# EAGLE schematic voice board (EAGLE 7.2.0)
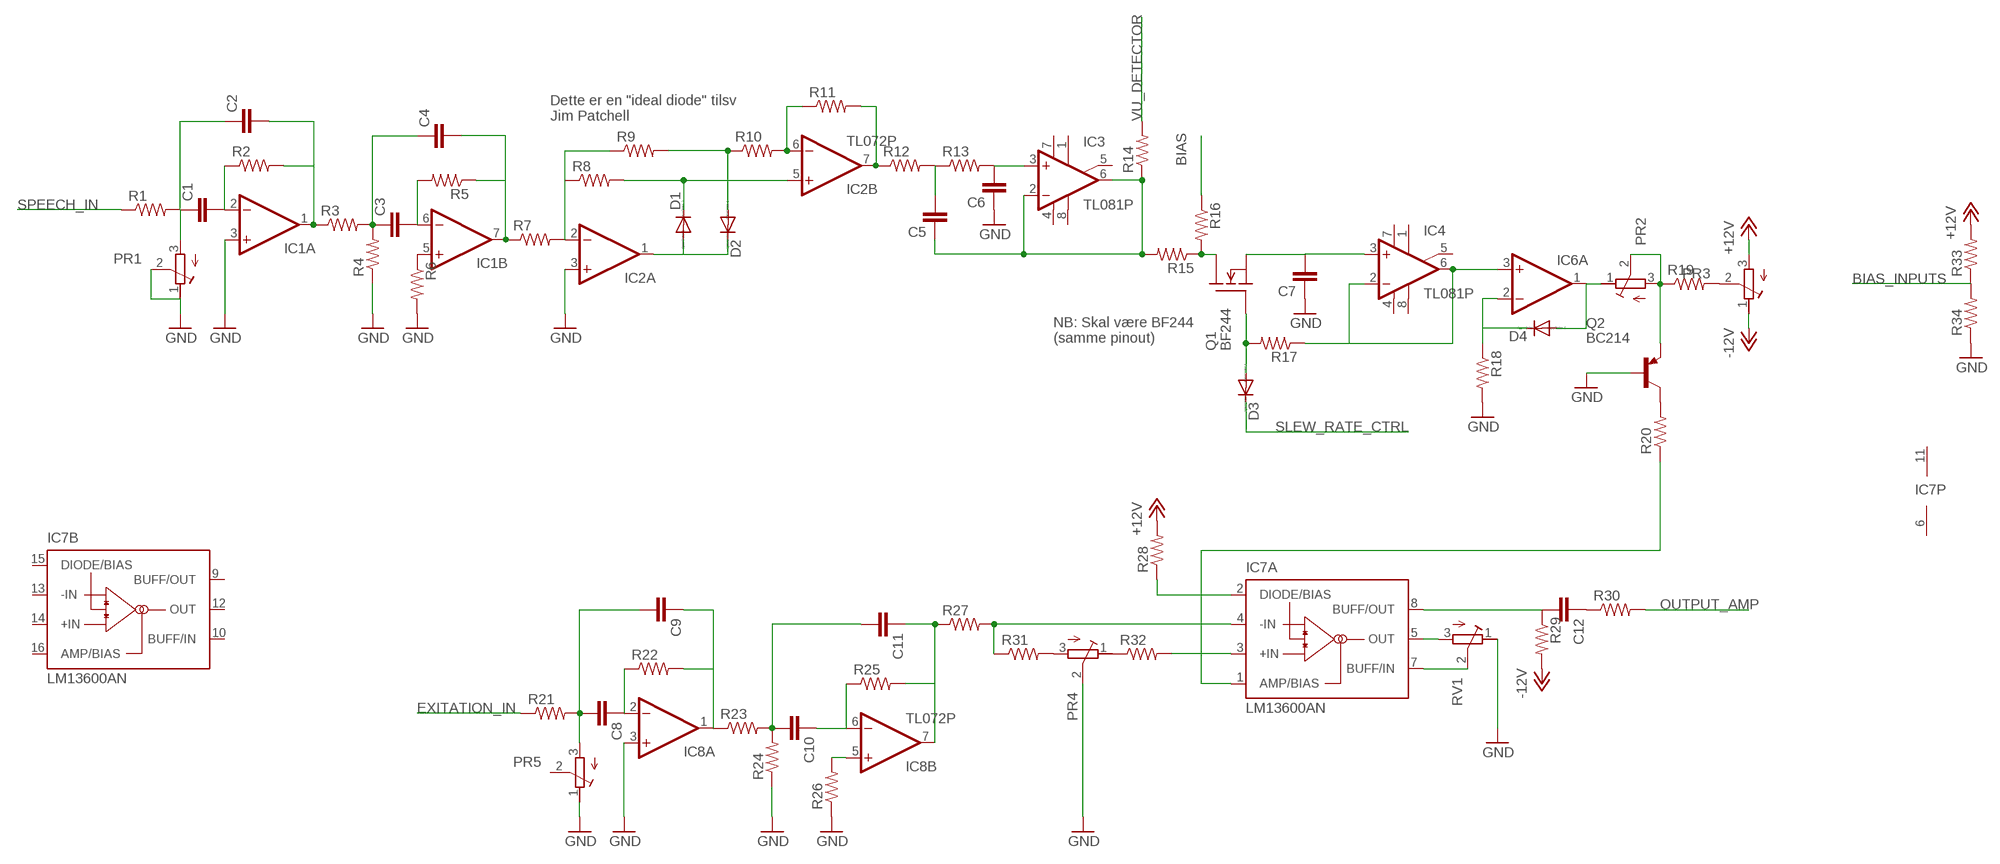
[diagram p0: schematic, sheet 1]

## Parts
C1  C-EU050-025X075  [C050-025X075]
C2  C-EU050-025X075  [C050-025X075]
C3  C-EU050-025X075  [C050-025X075]
C4  C-EU050-025X075  [C050-025X075]
C5  C-EU050-025X075  [C050-025X075]
C6  C-EU050-025X075  [C050-025X075]
C7  C-EU050-025X075  [C050-025X075]
C8  C-EU050-025X075  [C050-025X075]
C9  C-EU050-025X075  [C050-025X075]
C10  C-EU050-025X075  [C050-025X075]
C11  C-EU050-025X075  [C050-025X075]
C12  C-EU050-025X075  [C050-025X075]
D1  DIODE-D-5  [D-5]
D2  DIODE-D-5  [D-5]
D3  DIODE-D-5  [D-5]
D4  DIODE-D-5  [D-5]
IC1  TL072P  [DIL08]
IC2  TL072P  [DIL08]
IC3  TL081P  [DIL08]
IC4  TL081P  [DIL08]
IC6  TL072P  [DIL08]
IC7  LM13600AN  [DIL16]
IC8  TL072P  [DIL08]
PR1  R-TRIMMT93XA  [RTRIMT93XA]
PR2  R-TRIMMT93XA  [RTRIMT93XA]
PR3  R-TRIMMT93XA  [RTRIMT93XA]
PR4  R-TRIMMT93XA  [RTRIMT93XA]
PR5  R-TRIMMT93XA  [RTRIMT93XA]
Q1  BF244  TN0602N3  [TO-92]
Q2  BC214  [TO92]
R1  R-US_0207/7  [0207/7]
R2  R-US_0207/7  [0207/7]
R3  R-US_0207/7  [0207/7]
R4  R-US_0207/7  [0207/7]
R5  R-US_0207/7  [0207/7]
R6  R-US_0207/7  [0207/7]
R7  R-US_0207/7  [0207/7]
R8  R-US_0207/7  [0207/7]
R9  R-US_0207/7  [0207/7]
R10  R-US_0207/7  [0207/7]
R11  R-US_0207/7  [0207/7]
R12  R-US_0207/7  [0207/7]
R13  R-US_0207/7  [0207/7]
R14  R-US_0207/7  [0207/7]
R15  R-US_0207/7  [0207/7]
R16  R-US_0207/7  [0207/7]
R17  R-US_0207/7  [0207/7]
R18  R-US_0207/7  [0207/7]
R19  R-US_0207/7  [0207/7]
R20  R-US_0207/7  [0207/7]
R21  R-US_0207/7  [0207/7]
R22  R-US_0207/7  [0207/7]
R23  R-US_0207/7  [0207/7]
R24  R-US_0207/7  [0207/7]
R25  R-US_0207/7  [0207/7]
R26  R-US_0207/7  [0207/7]
R27  R-US_0207/7  [0207/7]
R28  R-US_0207/7  [0207/7]
R29  R-US_0207/7  [0207/7]
R30  R-US_0207/7  [0207/7]
R31  R-US_0207/7  [0207/7]
R32  R-US_0207/7  [0207/7]
R33  R-US_0207/7  [0207/7]
R34  R-US_0207/7  [0207/7]
RV1  R-TRIMMT93XA  [RTRIMT93XA]

## Nets
+12V: PR3.3(A) R28.2 R33.2
-12V: PR3.1(E) R29.2
BIAS: R16.1
BIAS_INPUTS: R33.1 R34.2
EXITATION_IN: R21.1
GND: C6.1 C7.1 IC1.3(A:+IN) IC2.3(A:+IN) IC8.3(A:+IN) PR1.1(E) PR1.2(S) PR4.2(S) PR5.1(E) Q2.2(B) R4.1 R6.2 R18.2 R24.1 R26.1 R34.1 RV1.1(E)
N$1: C1.2 IC1.2(A:-IN) R2.1
N$2: C1.1 C2.1 PR1.3(A) R1.2
N$3: C2.2 IC1.1(A:OUT) R2.2 R3.1
N$4: IC2.2(A:-IN) R7.2 R8.1 R9.1
N$5: C3.1 C4.1 R3.2 R4.2
N$6: C3.2 IC1.6(B:-IN) R5.2
N$7: IC1.5(B:+IN) R6.1
N$8: C4.2 IC1.7(B:OUT) R5.1 R7.1
N$9: D1.C IC2.5(B:+IN) R8.2
N$10: D1.A D2.C IC2.1(A:OUT)
N$11: D2.A R9.2 R10.1
N$12: IC2.6(B:-IN) R10.2 R11.1
N$13: IC2.7(B:OUT) R11.2 R12.1
N$14: C5.2 R12.2 R13.1
N$15: C5.1 IC3.2(-IN) IC3.6(OUT) R14.1 R15.2
N$16: C6.2 IC3.3(+IN) R13.2
N$17: Q1.3(D) R15.1 R16.2
N$18: C7.2 IC4.3(+IN) Q1.1(S)
N$19: D3.A Q1.2(G) R17.2
N$20: IC4.2(-IN) IC4.6(OUT) IC6.3(A:+IN) R17.1
N$21: D4.C IC6.2(A:-IN) R18.1
N$22: D4.A IC6.1(A:OUT) PR2.1(E)
N$23: PR2.2(S) PR2.3(A) Q2.1(E) R19.1
N$24: PR3.2(S) R19.2
N$25: Q2.3(C) R20.2
N$26: PR4.3(A) R31.2
N$27: C8.2 C9.2 PR5.3(A) R21.2
N$28: C10.2 C11.2 R23.2 R24.2
N$29: C8.1 IC8.2(A:-IN) R22.1
N$30: C9.1 IC8.1(A:OUT) R22.2 R23.1
N$31: C10.1 IC8.6(B:-IN) R25.1
N$32: IC8.5(B:+IN) R26.2
N$33: C12.2 IC7.8(A:BUFF/OUT) R29.1
N$34: C12.1 R30.1
N$35: C11.1 IC8.7(B:OUT) R25.2 R27.1
N$36: PR4.1(E) R32.1
N$37: IC7.3(A:+IN) R32.2
N$38: IC7.2(A:DIODE/BIAS) R28.1
N$39: IC7.4(A:-IN) R27.2 R31.1
N$40: IC7.1(A:AMP/BIAS) R20.1
N$41: IC7.5(A:OUT) RV1.3(A)
N$42: IC7.7(A:BUFF/IN) RV1.2(S)
OUTPUT_AMP: R30.2
SLEW_RATE_CTRL: D3.C
SPEECH_IN: R1.1
VU_DETECTOR: R14.2
Unconnected: IC3.1(ON1) IC3.5(ON2) IC3.8(OPT) IC4.1(ON1) IC4.5(ON2) IC4.8(OPT) IC6.5(B:+IN) IC6.6(B:-IN) IC6.7(B:OUT) IC7.9(B:BUFF/OUT) IC7.10(B:BUFF/IN) IC7.12(B:OUT) IC7.13(B:-IN) IC7.14(B:+IN) IC7.15(B:DIODE/BIAS) IC7.16(B:AMP/BIAS) PR5.2(S)

## Notes on the sheet
- Dette er en "ideal diode" tilsv
  Jim Patchell
- NB: Skal være BF244
  (samme pinout)

## Power pins joined to a net without a drawn wire
V+: IC1.8(P:V+) IC2.8(P:V+) IC3.7(V+) IC4.7(V+) IC6.8(P:V+) IC7.11(P:V+) IC8.8(P:V+)
V-: IC1.4(P:V-) IC2.4(P:V-) IC3.4(V-) IC4.4(V-) IC6.4(P:V-) IC7.6(P:V-) IC8.4(P:V-)

## Library data of the parts
C1-C12 = resistor:C-EU: CAPACITOR, European symbol
D1-D4 = diode:DIODE-: DIODE
IC1 IC2 IC6 IC8 = linear:TL072: OP AMP
IC3 IC4 = linear:TL081: OP AMP
IC7 = national-semiconductor:LM13600: Dual Operational Transconductance Amplifiers with Linearizing Diodes and Buffers Source: lm13600.PDF
PR1-PR5 RV1 = resistor:R-TRIMM: Trimm resistor
Q1 = transistor-fet:TN0602N3: N-Channel Enhancement MOSFET 20V; 4A; 0,75Ohm
Q2 = transistor-pnp:BC214: PNP Transistor
R1-R34 = resistor:R-US_: RESISTOR, American symbol